# EAGLE design musIR-tiny-mk-1.0.2 (EAGLE 7.5.0)
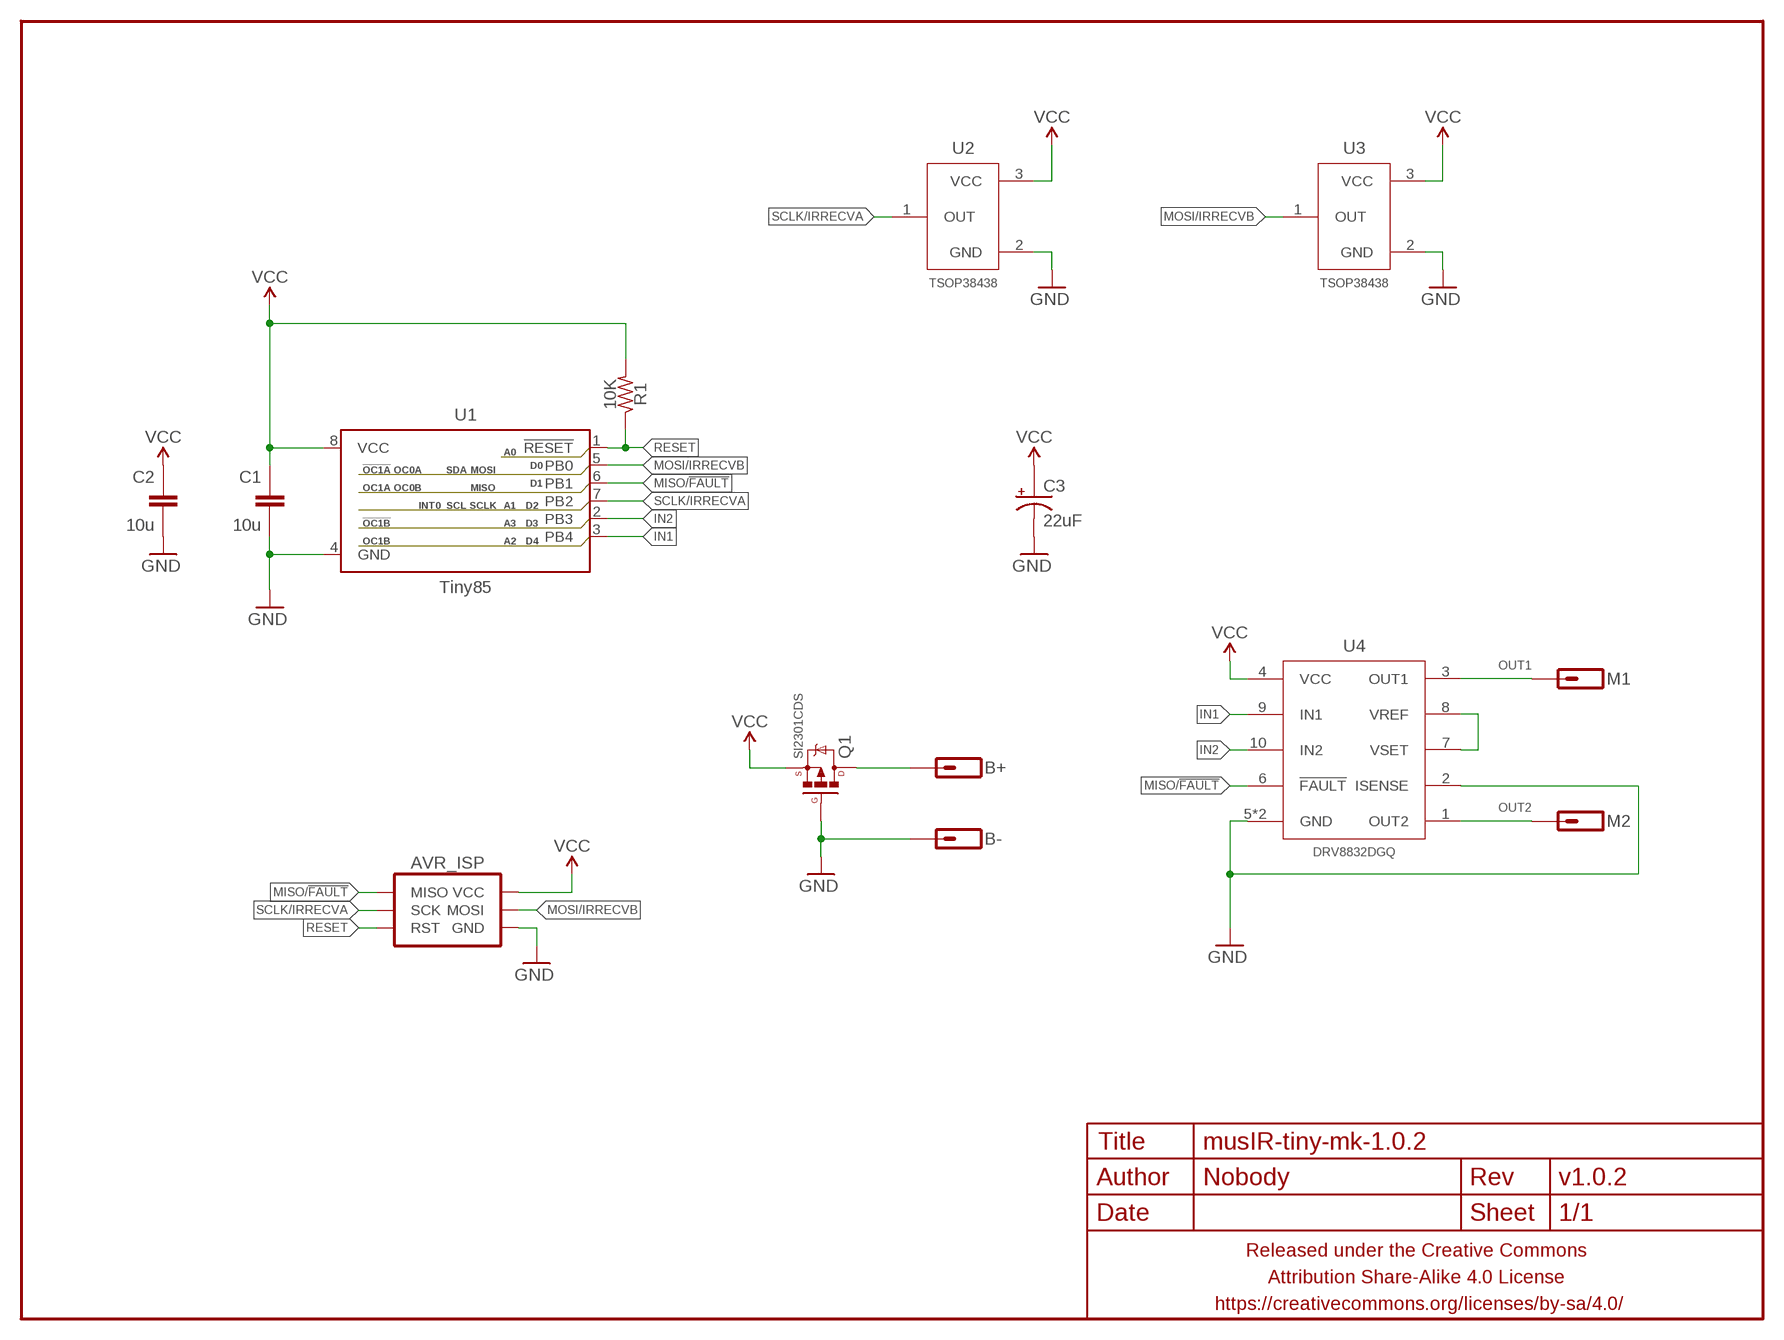
[diagram p0: schematic, sheet 1]

## Parts
AVR_ISP  AVR_SPI_PRG_6TESTPOINTS  [2X3_TEST_POINTS]
B+  M01PTH  [1X01]
B-  M01PTH  [1X01]
C1  10u  CAPACITOR-CERAMICC0805-TIGHTER  [C0805-TIGHTER]
C2  10u  CAPACITOR-CERAMICC0805-TIGHTER  [C0805-TIGHTER]
C3  22uF  CAPACITOR-POLARIZEDC/6032-28R  [C/6032-28R]
FRAME1  FRAME-LETTERNO_PACKAGE  [DUMMY]
M1  M01PTH  [1X01]
M2  M01PTH  [1X01]
Q1  SI2301CDS  MOSFET-PCHANNELSOT-23  [SOT23]
R1  10K  RESISTORR0603-TIGHTER  [R0603-TIGHTER]
U1  Tiny85  ATTINY45TINY85-20-SOICW  [SO08-EIAJ]
U2  TSOP38438  TSOP382__/4__  [TSOP38238]
U3  TSOP38438  TSOP382__/4__  [TSOP38238]
U4  DRV8832DGQ  [MSOP-10-PAD]

## Nets
GND: AVR_ISP.6(GND) B-.1 C1.2 C2.2 C3.- Q1.1(G) U1.4(GND) U2.2(GND) U3.2(GND) U4.2(ISENSE) U4.5(GND) U4.PAD(GND)
IN1: U1.3(PB4) U4.9(IN1)
IN2: U1.2(PB3) U4.10(IN2)
MISO/!FAULT: AVR_ISP.1(MISO) U1.6(PB1) U4.6(!FAULT)
MOSI/IRRECVB: AVR_ISP.4(MOSI) U1.5(PB0) U3.1(OUT)
N$1: B+.1 Q1.3(D)
N$2: U4.7(VSET) U4.8(VREF)
OUT1: M1.1 U4.3(OUT1)
OUT2: M2.1 U4.1(OUT2)
RESET: AVR_ISP.5(RST) R1.1 U1.1(!RESET)
SCLK/IRRECVA: AVR_ISP.3(SCK) U1.7(PB2) U2.1(OUT)
VCC: AVR_ISP.2(VCC) C1.1 C2.1 C3.+ Q1.2(S) R1.2 U1.8(VCC) U2.3(VCC) U3.3(VCC) U4.4(VCC)

## Library data of the parts
AVR_ISP = a_parts:AVR_SPI_PRG_6: AVR ISP 6 Pin This is the reduced ISP connector for AVR programming. Common on Arduino. This footprint will take up less PCB space and can be used with a 10-pin to 6-pin adapter such as SKU: BOB-08508 **Special note about "TEST_POINT" package. The stop mask is on the top side, so if you want your programming test points to be on the bottom of your board, make sure to place this package on the bottom side of the board. This also ensure that the orientation to program from the bottom side will be correct.
B+ B- M1 M2 = a_parts:M01: Header 1 Standard 1-pin 0.1" header. Use with straight break away headers (SKU : PRT-00116), right angle break away headers (PRT-00553), swiss pins (PRT-00743), machine pins (PRT-00117), and female headers (PRT-00115).
C1 C2 = a_parts:CAPACITOR-CERAMIC: CAPACITOR, European symbol
C3 = a_parts:CAPACITOR-POLARIZED: POLARIZED CAPACITOR, American symbol
FRAME1 = a_parts:FRAME-LETTER: Schematic Frame Standard 8.5x11 US Letter frame; DESIGNER: Nobody; VERSION: v1.0.2
Q1 = a_parts:MOSFET-PCHANNEL: Generic PMOSFET IRLML2244 - TRANS-11153 (SOT-23 -20V -4.3A) (1.Gate 2.Source 3.Drain) FQP27P06 - COM-10349 <http://www.sparkfun.com/products/10349> (TO-220 -60V -27A) (1.Gate 2.Source 3.Drain)
R1 = a_parts:RESISTOR: RESISTOR, American symbol
U1 = a_parts:ATTINY45: Atmel 8-pin 2/4/8kB flash uC; PROD_ID: IC-09092; VALUE: Tiny85-20-SMT
U2 U3 = a_parts:TSOP382__/4__
U4 = a_parts:DRV8832

## Board
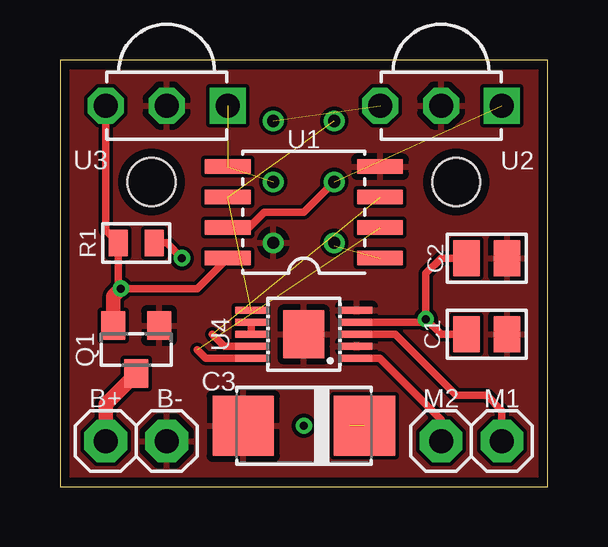
[diagram p1: board, top side]
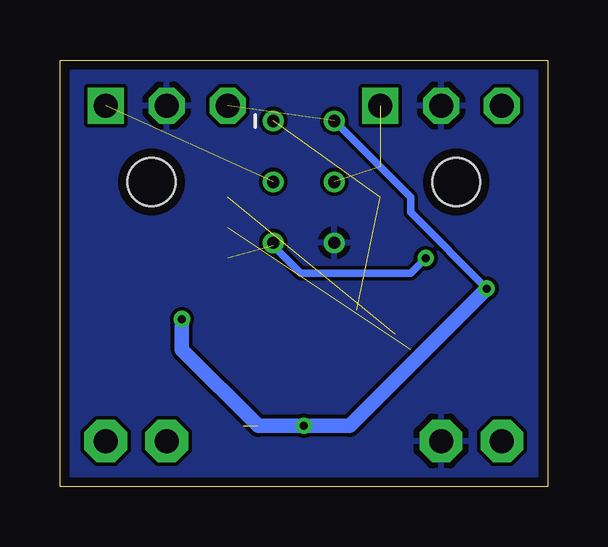
[diagram p2: board, bottom side, seen from below]

Size 20.32 x 17.78 mm. Coordinates in mm from the lower left corner, seen from the top.
Outline: 0,0 20.32,0 20.32,17.78 0,17.78 0,0
Copper layers (1*16): Top 0.0356mm / dielectric 1.5011mm / Bottom 0.0356mm
Design rules "LaenPCBOrder2": minimum track width 6mil, minimum drill 13mil, track to track 6mil, track to pad 6mil, pad to pad 6mil, via to via 6mil, smd to smd 6mil, copper to edge 15mil, drill to drill 6mil, minimum pad ring 7mil, minimum via ring 7mil, stop-mask expansion 3mil, vias tented up to drill 20mil, thermal gap 10mil
Holes 2 mm at 3.81,12.7 16.51,12.7

### Footprints (pad centres in the part's own frame; a part is rotated, then mirrored left to right if it is on the bottom)
2X3_TEST_POINTS = drill 0.508: 1 -2.54,-1.27; 2 -2.54,1.27; 3 0,-1.27; 4 0,1.27; 5 2.54,-1.27; 6 2.54,1.27
1X01 = drill 1 pad 1.778 octagon: 1 0,0
C0805-TIGHTER = smd 1.1 x 1.5: 1 -0.85,0; 2 0.85,0
C/6032-28R = smd 2.55 x 2.5: + 2.525,0; - -2.525,0
SOT23 = smd 1 x 1.2: 1 -0.95,-1; 2 0.95,-1; 3 0,1
R0603-TIGHTER = smd 0.8 x 1.1: 1 -0.75,0; 2 0.75,0
SO08-EIAJ = smd 0.61 x 1.905: 1 -1.905,-3.175; 2 -0.635,-3.175; 3 0.635,-3.175; 4 1.905,-3.175; 5 1.905,3.175; 6 0.635,3.175; 7 -0.635,3.175; 8 -1.905,3.175
TSOP38238 = drill 1 square: 1 -2.54,0 | drill 1 octagon: 2 0,0; 3 2.54,0
MSOP-10-PAD = smd 0.3 x 1.3: 1 -1,-2.2; 2 -0.5,-2.2; 3 0,-2.2; 4 0.5,-2.2; 5 1,-2.2; 6 1,2.2; 7 0.5,2.2; 8 0,2.2; 9 -0.5,2.2; 10 -1,2.2 | smd 2 x 1.7: PAD 0,0

### Placement (x,y rotation side)
AVR_ISP  10.16,12.7 270 bottom
B+  1.91,1.91 270 top
B-  4.45,1.91 90 top
C1  17.78,6.35 0 top
C2  17.78,9.53 0 top
C3  10.16,2.54 0 top
FRAME1  0,0 0 top
M1  18.41,1.91 0 top
M2  15.88,1.91 0 top
Q1  3.17,5.71 180 top
R1  3.17,10.16 180 top
U1  10.16,11.43 90 top
U2  15.88,15.88 180 top
U3  4.45,15.88 180 top
U4  10.16,6.35 90 top

### Tracks (layer width: path | path; a pad name or v marks a point on that pad's centre or on a via)
GND
  pour Top (rank 6): 0,0 20.32,0 20.32,17.78 0,17.78
  pour Bottom (rank 6): 0,0 20.32,0 20.32,17.78 0,17.78
IN1  (1 unrouted)
  Top 0.305: U4.9 6.85,5.85 6.35,6.35
IN2  (1 unrouted)
  Top 0.305: U4.10 6.08,5.35 5.71,5.71
MISO/!FAULT  (2 unrouted)
MOSI/IRRECVB  (2 unrouted)
N$1
  Top 0.61: B+.1 1.91,3.44 Q1.3
N$2
  Top 0.305: U4.8 U4.7
OUT1
  Top 0.305: U4.3 13.97,6.35 16.51,3.81 17.78,3.81 18.41,3.17 M1.1
OUT2
  Top 0.305: U4.1 13.32,5.35 15.88,2.79 M2.1
RESET  (via drill 0.33)  (1 unrouted)
  Top 0.305: R1.1 4.45,10.16 v5.08,9.53
  Bottom 0.305: v5.08,9.53 5.71,8.89 10.29,8.89 11.43,10.03 AVR_ISP.5
SCLK/IRRECVA  (1 unrouted)
  Top 0.305: U1.7 7.87,10.79 8.51,11.43 10.16,11.43 AVR_ISP.3
VCC  (via drill 0.33)  (2 unrouted)
  Top 0.305: U4.4 15.11,6.85 v15.24,6.99 | C1.1 15.88,6.35 v15.24,6.99 | C2.1 15.88,9.53 15.24,8.89 v15.24,6.99 | U1.8 5.71,8.26 v2.54,8.26 2.42,8.37 R1.2 1.91,10.68 U3.3
  Top 0.61: Q1.2 2.23,7.94 v2.54,8.26
  Bottom 0.305: AVR_ISP.2 5.71,12.06 5.71,11.43 v2.54,8.26
  Bottom 0.61: v2.54,8.26 8.26,2.54 v10.16,2.54 12.06,2.54 15.24,5.71 v15.24,6.99